# Altium schematic sheet analog_adc_front_end.SchDoc
size A3
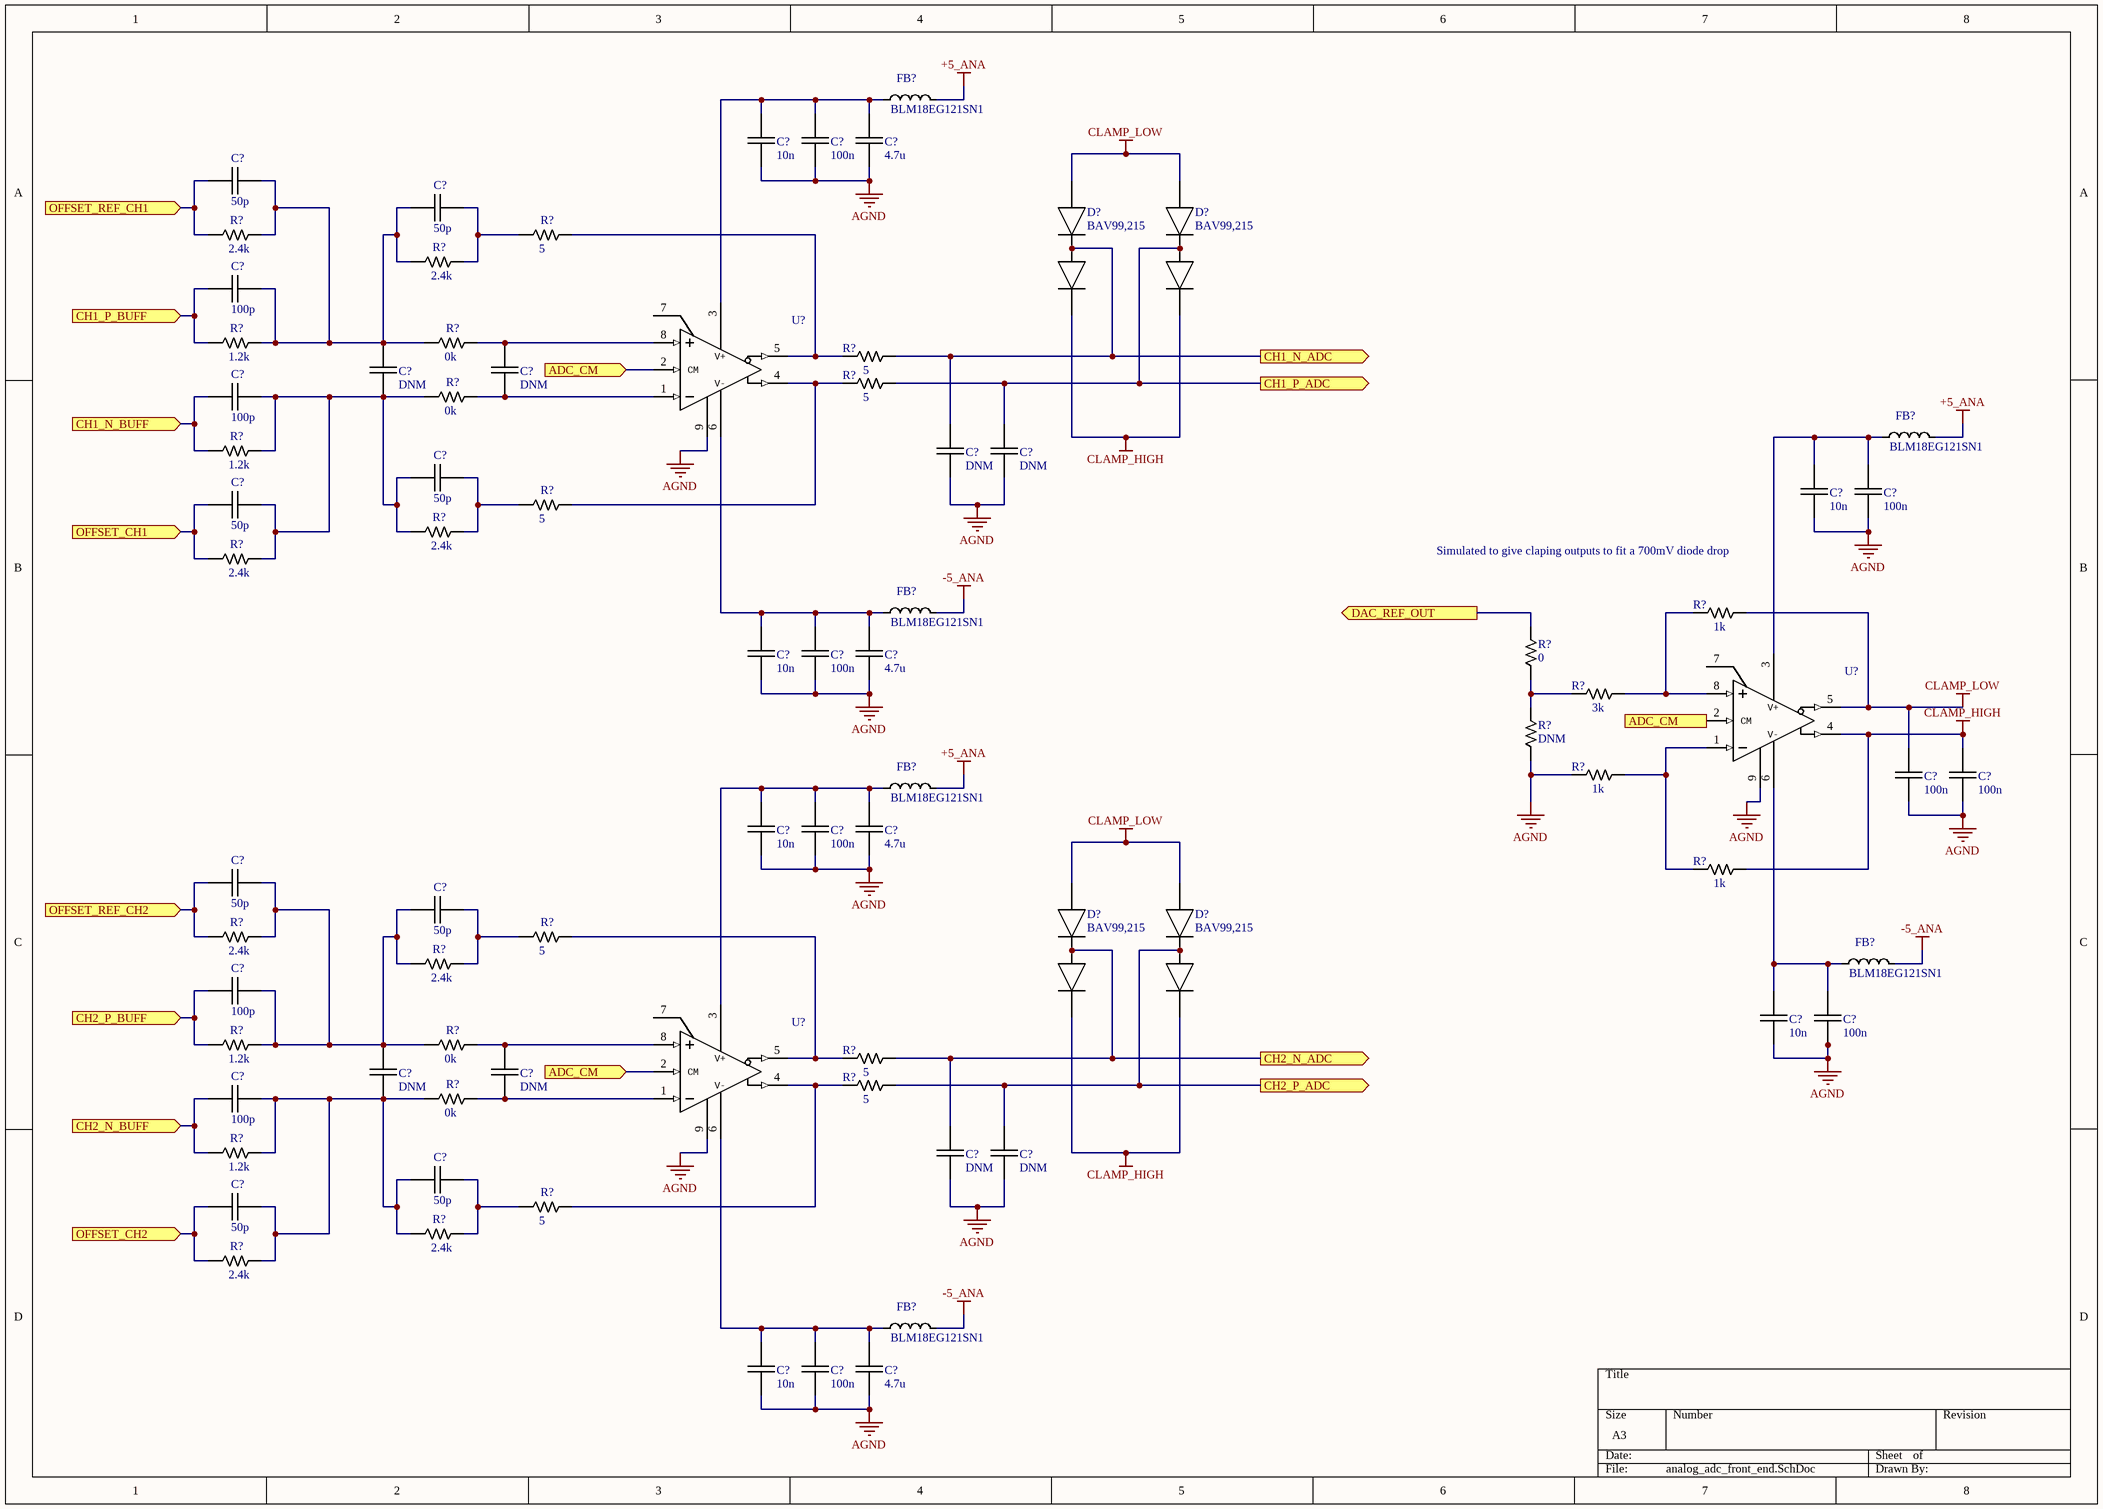
[diagram p0: analog_adc_front_end.SchDoc]

## Parts
(Parts that share a designator on the sheet are numbered #1, #2 ... from top to bottom, then left to right.)
C?#1  value 10n  [CAPC1005X06N]  (hidden comment: MLLC Capacitor)
C?#2  value 100n  [CAPC1005X06N]  (hidden comment: MLLC Capacitor)
C?#3  value 4.7u  [CAPC1608X09N]  (hidden comment: MLLC Capacitor)
C?#4  value 50p  [CAPC1005X06N]  (hidden comment: MLLC Capacitor)
C?#5  value 50p  [CAPC1005X06N]  (hidden comment: MLLC Capacitor)
C?#6  value 100p  [CAPC1005X06N]  (hidden comment: MLLC Capacitor)
C?#7  value DNM  [CAPC1005X06N]  (hidden comment: MLLC Capacitor)
C?#8  value DNM  [CAPC1005X06N]  (hidden comment: MLLC Capacitor)
C?#9  value 100p  [CAPC1005X06N]  (hidden comment: MLLC Capacitor)
C?#10  value DNM  [CAPC1005X06N]  (hidden comment: MLLC Capacitor)
C?#11  value DNM  [CAPC1005X06N]  (hidden comment: MLLC Capacitor)
C?#12  value 50p  [CAPC1005X06N]  (hidden comment: MLLC Capacitor)
C?#13  value 10n  [CAPC1005X06N]  (hidden comment: MLLC Capacitor)
C?#14  value 100n  [CAPC1005X06N]  (hidden comment: MLLC Capacitor)
C?#15  value 50p  [CAPC1005X06N]  (hidden comment: MLLC Capacitor)
C?#16  value 10n  [CAPC1005X06N]  (hidden comment: MLLC Capacitor)
C?#17  value 100n  [CAPC1005X06N]  (hidden comment: MLLC Capacitor)
C?#18  value 4.7u  [CAPC1608X09N]  (hidden comment: MLLC Capacitor)
C?#19  value 100n  [CAPC1005X06N]  (hidden comment: MLLC Capacitor)
C?#20  value 100n  [CAPC1005X06N]  (hidden comment: MLLC Capacitor)
C?#21  value 10n  [CAPC1005X06N]  (hidden comment: MLLC Capacitor)
C?#22  value 100n  [CAPC1005X06N]  (hidden comment: MLLC Capacitor)
C?#23  value 4.7u  [CAPC1608X09N]  (hidden comment: MLLC Capacitor)
C?#24  value 50p  [CAPC1005X06N]  (hidden comment: MLLC Capacitor)
C?#25  value 50p  [CAPC1005X06N]  (hidden comment: MLLC Capacitor)
C?#26  value 100p  [CAPC1005X06N]  (hidden comment: MLLC Capacitor)
C?#27  value 10n  [CAPC1005X06N]  (hidden comment: MLLC Capacitor)
C?#28  value 100n  [CAPC1005X06N]  (hidden comment: MLLC Capacitor)
C?#29  value DNM  [CAPC1005X06N]  (hidden comment: MLLC Capacitor)
C?#30  value DNM  [CAPC1005X06N]  (hidden comment: MLLC Capacitor)
C?#31  value 100p  [CAPC1005X06N]  (hidden comment: MLLC Capacitor)
C?#32  value DNM  [CAPC1005X06N]  (hidden comment: MLLC Capacitor)
C?#33  value DNM  [CAPC1005X06N]  (hidden comment: MLLC Capacitor)
C?#34  value 50p  [CAPC1005X06N]  (hidden comment: MLLC Capacitor)
C?#35  value 50p  [CAPC1005X06N]  (hidden comment: MLLC Capacitor)
C?#36  value 10n  [CAPC1005X06N]  (hidden comment: MLLC Capacitor)
C?#37  value 100n  [CAPC1005X06N]  (hidden comment: MLLC Capacitor)
C?#38  value 4.7u  [CAPC1608X09N]  (hidden comment: MLLC Capacitor)
D?#1  BAV99,215  [SOT95P245X110-3N]
D?#2  BAV99,215  [SOT95P245X110-3N]
D?#3  BAV99,215  [SOT95P245X110-3N]
D?#4  BAV99,215  [SOT95P245X110-3N]
FB?#1  value BLM18EG121SN1  [INDC1608X08N]  (hidden comment: Chip Inductor)
FB?#2  value BLM18EG121SN1  [INDC1608X08N]  (hidden comment: Chip Inductor)
FB?#3  value BLM18EG121SN1  [INDC1608X08N]  (hidden comment: Chip Inductor)
FB?#4  value BLM18EG121SN1  [INDC1608X08N]  (hidden comment: Chip Inductor)
FB?#5  value BLM18EG121SN1  [INDC1608X08N]  (hidden comment: Chip Inductor)
FB?#6  value BLM18EG121SN1  [INDC1608X08N]  (hidden comment: Chip Inductor)
R?#1  value 2.4k  [RESC1005X04N]  (hidden comment: Chip Resistor)
R?#2  value 5  [RESC1005X04N]  (hidden comment: Chip Resistor)
R?#3  value 2.4k  [RESC1005X04N]  (hidden comment: Chip Resistor)
R?#4  value 1.2k  [RESC1005X04N]  (hidden comment: Chip Resistor)
R?#5  value 0k  [RESC1005X04N]  (hidden comment: Chip Resistor)
R?#6  value 5  [RESC1005X04N]  (hidden comment: Chip Resistor)
R?#7  value 5  [RESC1005X04N]  (hidden comment: Chip Resistor)
R?#8  value 0k  [RESC1005X04N]  (hidden comment: Chip Resistor)
R?#9  value 1.2k  [RESC1005X04N]  (hidden comment: Chip Resistor)
R?#10  value 5  [RESC1005X04N]  (hidden comment: Chip Resistor)
R?#11  value 2.4k  [RESC1005X04N]  (hidden comment: Chip Resistor)
R?#12  value 2.4k  [RESC1005X04N]  (hidden comment: Chip Resistor)
R?#13  value 1k  [RESC1005X04N]  (hidden comment: Chip Resistor)
R?#14  value 0  [RESC1005X04N]  (hidden comment: Chip Resistor)
R?#15  value 3k  [RESC1005X04N]  (hidden comment: Chip Resistor)
R?#16  value DNM  [RESC1005X04N]  (hidden comment: Chip Resistor)
R?#17  value 1k  [RESC1005X04N]  (hidden comment: Chip Resistor)
R?#18  value 1k  [RESC1005X04N]  (hidden comment: Chip Resistor)
R?#19  value 2.4k  [RESC1005X04N]  (hidden comment: Chip Resistor)
R?#20  value 5  [RESC1005X04N]  (hidden comment: Chip Resistor)
R?#21  value 2.4k  [RESC1005X04N]  (hidden comment: Chip Resistor)
R?#22  value 1.2k  [RESC1005X04N]  (hidden comment: Chip Resistor)
R?#23  value 0k  [RESC1005X04N]  (hidden comment: Chip Resistor)
R?#24  value 5  [RESC1005X04N]  (hidden comment: Chip Resistor)
R?#25  value 5  [RESC1005X04N]  (hidden comment: Chip Resistor)
R?#26  value 0k  [RESC1005X04N]  (hidden comment: Chip Resistor)
R?#27  value 1.2k  [RESC1005X04N]  (hidden comment: Chip Resistor)
R?#28  value 5  [RESC1005X04N]  (hidden comment: Chip Resistor)
R?#29  value 2.4k  [RESC1005X04N]  (hidden comment: Chip Resistor)
R?#30  value 2.4k  [RESC1005X04N]  (hidden comment: Chip Resistor)
U?#1  THS4131CDGN  [DGN0008D_N]  (value not drawn)
U?#2  THS4131CDGN  [DGN0008D_N]  (value not drawn)
U?#3  THS4131CDGN  [DGN0008D_N]  (value not drawn)

## Ports
ADC_CM (in), CH1_N_ADC (out), CH1_N_BUFF (in), CH1_P_ADC (out), CH1_P_BUFF (in), CH2_N_ADC (out), CH2_N_BUFF (in), CH2_P_ADC (out), CH2_P_BUFF (in), DAC_REF_OUT (out), OFFSET_CH1 (in), OFFSET_CH2 (in), OFFSET_REF_CH1 (in), OFFSET_REF_CH2 (in)

## Nets
+5_ANA: FB?#1.2 FB?#2.2 FB?#4.2
-5_ANA: FB?#3.2 FB?#5.2 FB?#6.2
AGND: C?#1.1 C?#2.1 C?#3.1 C?#10.1 C?#11.1 C?#13.1 C?#14.1 C?#16.1 C?#17.1 C?#18.1 C?#19.1 C?#20.1 C?#21.1 C?#22.1 C?#23.1 C?#27.1 C?#28.1 C?#32.1 C?#33.1 C?#36.1 C?#37.1 C?#38.1 R?#16.1 R?#17.1 U?#1.9(PAD) U?#2.9(PAD) U?#3.9(PAD)
CLAMP_HIGH: C?#20.2 D?#1.2 D?#2.2 D?#3.2 D?#4.2 R?#18.2 U?#2.4(VOUT+)
CLAMP_LOW: C?#19.2 D?#1.1 D?#2.1 D?#3.1 D?#4.1 R?#13.2 U?#2.5(VOUT-)
ADC_CM: U?#1.2(VOCM) U?#2.2(VOCM) U?#3.2(VOCM) ; port ADC_CM
CH1_N_ADC: C?#10.2 D?#1.3 R?#6.2 ; port CH1_N_ADC
CH1_N_BUFF: C?#9.1 R?#9.1 ; port CH1_N_BUFF
CH1_P_ADC: C?#11.2 D?#2.3 R?#7.2 ; port CH1_P_ADC
CH1_P_BUFF: C?#6.1 R?#4.1 ; port CH1_P_BUFF
CH2_N_ADC: C?#32.2 D?#3.3 R?#24.2 ; port CH2_N_ADC
CH2_N_BUFF: C?#31.1 R?#27.1 ; port CH2_N_BUFF
CH2_P_ADC: C?#33.2 D?#4.3 R?#25.2 ; port CH2_P_ADC
CH2_P_BUFF: C?#26.1 R?#22.1 ; port CH2_P_BUFF
DAC_REF_OUT: R?#14.2 ; port DAC_REF_OUT
OFFSET_CH1: C?#15.1 R?#12.1 ; port OFFSET_CH1
OFFSET_CH2: C?#35.1 R?#30.1 ; port OFFSET_CH2
OFFSET_REF_CH1: C?#4.1 R?#1.1 ; port OFFSET_REF_CH1
OFFSET_REF_CH2: C?#24.1 R?#19.1 ; port OFFSET_REF_CH2
NetC?#1_2: C?#1.2 C?#2.2 C?#3.2 FB?#1.1 U?#1.3(VCC+)
NetC?#4_2: C?#4.2 C?#5.1 C?#6.2 C?#7.2 R?#1.2 R?#3.1 R?#4.2 R?#5.1
NetC?#5_2: C?#5.2 R?#2.1 R?#3.2
NetC?#7_1: C?#7.1 C?#9.2 C?#12.1 C?#15.2 R?#8.1 R?#9.2 R?#11.1 R?#12.2
NetC?#8_1: C?#8.1 R?#8.2 U?#1.1(VIN-)
NetC?#8_2: C?#8.2 R?#5.2 U?#1.8(VIN+)
NetC?#12_2: C?#12.2 R?#10.1 R?#11.2
NetC?#13_2: C?#13.2 C?#14.2 FB?#2.1 U?#2.3(VCC+)
NetC?#16_2: C?#16.2 C?#17.2 C?#18.2 FB?#3.1 U?#1.6(VCC-)
NetC?#21_2: C?#21.2 C?#22.2 C?#23.2 FB?#4.1 U?#3.3(VCC+)
NetC?#24_2: C?#24.2 C?#25.1 C?#26.2 C?#29.2 R?#19.2 R?#21.1 R?#22.2 R?#23.1
NetC?#25_2: C?#25.2 R?#20.1 R?#21.2
NetC?#27_2: C?#27.2 C?#28.2 FB?#5.1 U?#2.6(VCC-)
NetC?#29_1: C?#29.1 C?#31.2 C?#34.1 C?#35.2 R?#26.1 R?#27.2 R?#29.1 R?#30.2
NetC?#30_1: C?#30.1 R?#26.2 U?#3.1(VIN-)
NetC?#30_2: C?#30.2 R?#23.2 U?#3.8(VIN+)
NetC?#34_2: C?#34.2 R?#28.1 R?#29.2
NetC?#36_2: C?#36.2 C?#37.2 C?#38.2 FB?#6.1 U?#3.6(VCC-)
NetR?#2_2: R?#2.2 R?#6.1 U?#1.5(VOUT-)
NetR?#7_1: R?#7.1 R?#10.2 U?#1.4(VOUT+)
NetR?#13_1: R?#13.1 R?#15.2 U?#2.8(VIN+)
NetR?#14_1: R?#14.1 R?#15.1 R?#16.2
NetR?#17_2: R?#17.2 R?#18.1 U?#2.1(VIN-)
NetR?#20_2: R?#20.2 R?#24.1 U?#3.5(VOUT-)
NetR?#25_1: R?#25.1 R?#28.2 U?#3.4(VOUT+)

Not connected (* = marked no-connect by the designer): U?#1 7(NC); U?#2 7(NC); U?#3 7(NC)

## Notes on the sheet
- Simulated to give claping outputs to fit a 700mV diode drop
- (in symbol THS4131) V+; CM; V-

## Library data of the parts
C?#1-C?#38 = Cap: Rating: *
D?#1-D?#4 = BAV99,215: Diode Standard 100V 215mA Surface Mount SOT23, fast/ ultra-fast 4ns.
FB?#1-FB?#6 = Ind
R?#1-R?#30 = Res
U?#1-U?#3 = THS4131: Fully Differential Input/Output Low Noise Amplifier; PartNumber: THS4131CDGNR; Manufacturer: Texas Instruments; CompType: IC; PIN_COUNT: 9; Alternate_PartNumber: THS4131CDGN; PackageReference: DGN0008D; MountType: SMT; RoHS: Y; RefDes: RefDes; Type: DEV; Value: Value; Copyright: Copyright (C) 2018 Accelerated Designs. All rights reserved; ComponentLink1Description: Product Page; ComponentLink1URL: https://www.ti.com/product/THS4131